# Altium schematic sheet STM32.SchDoc
size A4
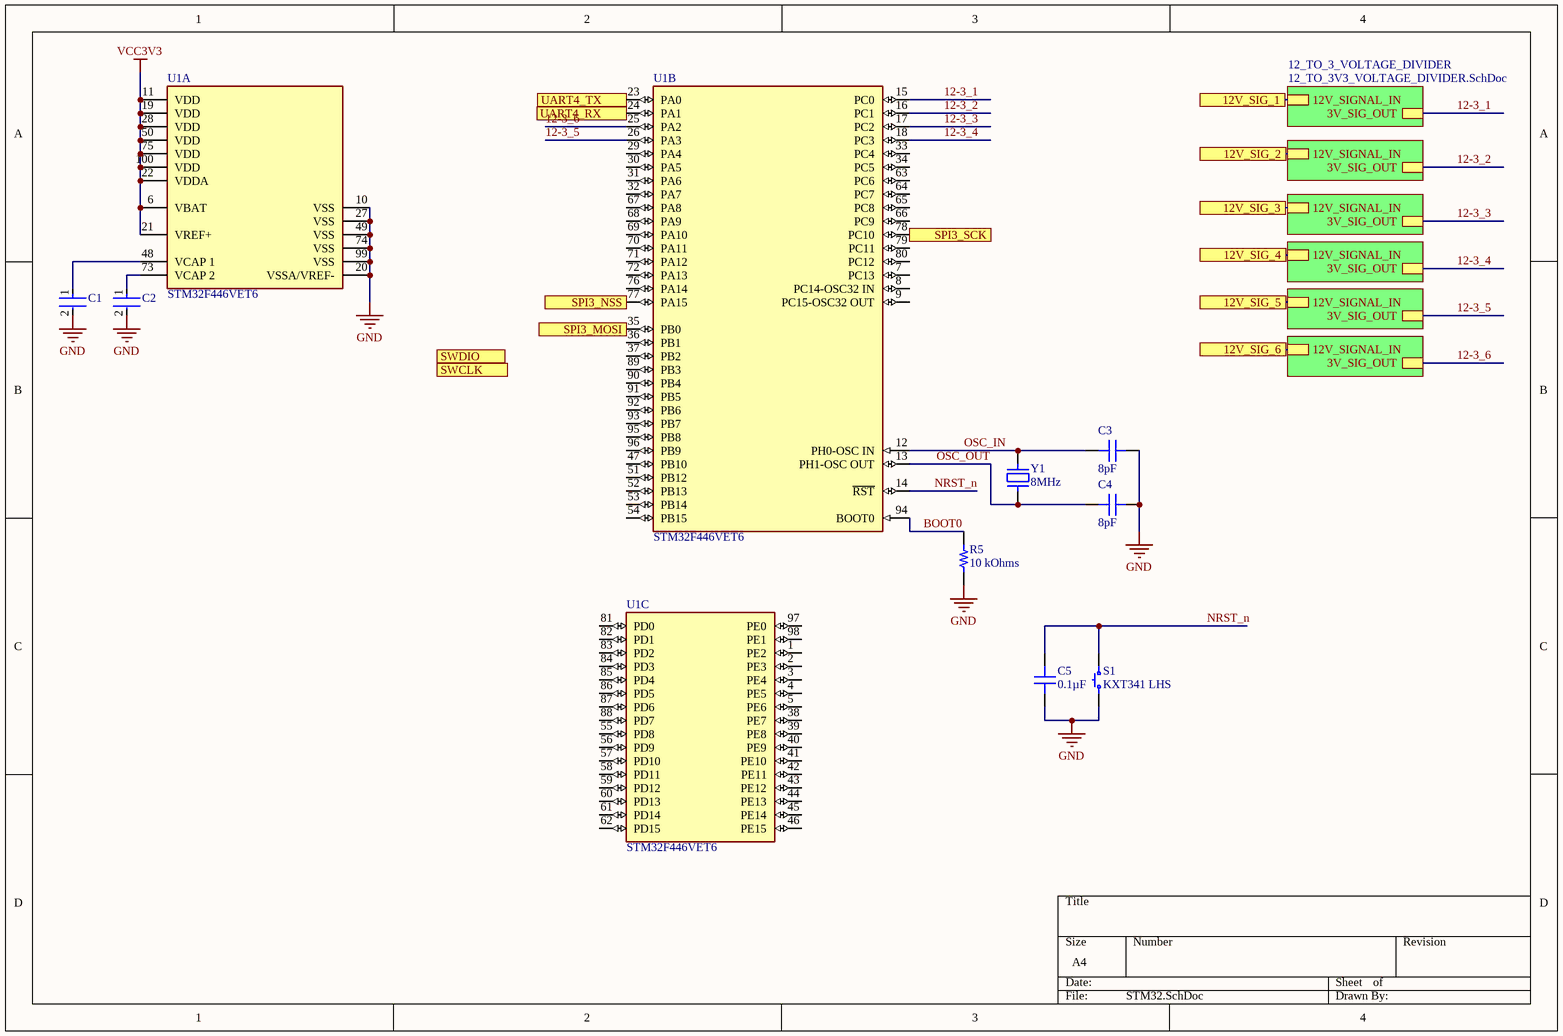
[diagram p0: STM32.SchDoc]

## Parts
C1  GRM188R71A225KE15D  [FP-GRM188-0_1-e0_2_0_5-MFG]  (value not drawn)
C2  GRM188R71A225KE15D  [FP-GRM188-0_1-e0_2_0_5-MFG]  (value not drawn)
C3  8pF  [CAP 0402_1005]
C4  8pF  [CAP 0402_1005]
C5  0.1µF  [CAP 0402_1005]
R5  10 kOhms  [RES 0402_1005]
S1  KXT341 LHS  [C&K KXT3]
U1  STM32F446VET6  [FP-LQFP100-1L-MFG]  (parts A,B,C of 3)
Y1  8MHz  [NDK NX3225GD]

## Sub-sheets
12_TO_3_VOLTAGE_DIVIDER = 12_TO_3V3_VOLTAGE_DIVIDER.SchDoc: 12V_SIGNAL_IN, 3V_SIG_OUT
12_TO_3_VOLTAGE_DIVIDER = 12_TO_3V3_VOLTAGE_DIVIDER.SchDoc: 12V_SIGNAL_IN, 3V_SIG_OUT
12_TO_3_VOLTAGE_DIVIDER = 12_TO_3V3_VOLTAGE_DIVIDER.SchDoc: 12V_SIGNAL_IN, 3V_SIG_OUT
12_TO_3_VOLTAGE_DIVIDER = 12_TO_3V3_VOLTAGE_DIVIDER.SchDoc: 12V_SIGNAL_IN, 3V_SIG_OUT
12_TO_3_VOLTAGE_DIVIDER = 12_TO_3V3_VOLTAGE_DIVIDER.SchDoc: 12V_SIGNAL_IN, 3V_SIG_OUT
12_TO_3_VOLTAGE_DIVIDER = 12_TO_3V3_VOLTAGE_DIVIDER.SchDoc: 12V_SIGNAL_IN, 3V_SIG_OUT

## Ports
12V_SIG_1, 12V_SIG_2, 12V_SIG_3, 12V_SIG_4, 12V_SIG_5, 12V_SIG_6, SPI3_MOSI, SPI3_NSS, SPI3_SCK, SWCLK, SWDIO, UART4_RX, UART4_TX

## Nets
GND: C1.2 C2.2 C3.2 C4.2 C5.1 R5.1 S1.1 U1.10(VSS) U1.20(VSSA/VREF-) U1.27(VSS) U1.49(VSS) U1.74(VSS) U1.99(VSS)
VCC3V3: U1.6(VBAT) U1.11(VDD) U1.19(VDD) U1.21(VREF+) U1.22(VDDA) U1.28(VDD) U1.50(VDD) U1.75(VDD) U1.100(VDD)
12-3_1: U1.15(PC0) ; sheet 12_TO_3_VOLTAGE_DIVIDER/3V_SIG_OUT
12-3_2: U1.16(PC1) ; sheet 12_TO_3_VOLTAGE_DIVIDER/3V_SIG_OUT
12-3_3: U1.17(PC2) ; sheet 12_TO_3_VOLTAGE_DIVIDER/3V_SIG_OUT
12-3_4: U1.18(PC3) ; sheet 12_TO_3_VOLTAGE_DIVIDER/3V_SIG_OUT
12-3_5: U1.26(PA3) ; sheet 12_TO_3_VOLTAGE_DIVIDER/3V_SIG_OUT
12-3_6: U1.25(PA2) ; sheet 12_TO_3_VOLTAGE_DIVIDER/3V_SIG_OUT
12V_SIG_1: port 12V_SIG_1, sheet 12_TO_3_VOLTAGE_DIVIDER/12V_SIGNAL_IN
12V_SIG_2: port 12V_SIG_2, sheet 12_TO_3_VOLTAGE_DIVIDER/12V_SIGNAL_IN
12V_SIG_3: port 12V_SIG_3, sheet 12_TO_3_VOLTAGE_DIVIDER/12V_SIGNAL_IN
12V_SIG_4: port 12V_SIG_4, sheet 12_TO_3_VOLTAGE_DIVIDER/12V_SIGNAL_IN
12V_SIG_5: port 12V_SIG_5, sheet 12_TO_3_VOLTAGE_DIVIDER/12V_SIGNAL_IN
12V_SIG_6: port 12V_SIG_6, sheet 12_TO_3_VOLTAGE_DIVIDER/12V_SIGNAL_IN
BOOT0: R5.2 U1.94(BOOT0)
NRST_n: C5.2 S1.2 U1.14(~{RST})
OSC_IN: C3.1 U1.12(PH0-OSC_IN) Y1.2
OSC_OUT: C4.1 U1.13(PH1-OSC_OUT) Y1.1
SPI3_MOSI: U1.35(PB0) ; port SPI3_MOSI
SPI3_NSS: U1.77(PA15) ; port SPI3_NSS
SPI3_SCK: U1.78(PC10) ; port SPI3_SCK
UART4_RX: U1.24(PA1) ; port UART4_RX
UART4_TX: U1.23(PA0) ; port UART4_TX
NetC1_1: C1.1 U1.48(VCAP_1)
NetC2_1: C2.1 U1.73(VCAP_2)

Not connected (* = marked no-connect by the designer): U1 1(PE2) 2(PE3) 3(PE4) 4(PE5) 5(PE6) 7(PC13) 8(PC14-OSC32_IN) 9(PC15-OSC32_OUT) 29(PA4) 30(PA5) 31(PA6) 32(PA7) 33(PC4) 34(PC5) 36(PB1) 37(PB2) 38(PE7) 39(PE8) 40(PE9) 41(PE10) 42(PE11) 43(PE12) 44(PE13) 45(PE14) 46(PE15) 47(PB10) 51(PB12) 52(PB13) 53(PB14) 54(PB15) 55(PD8) 56(PD9) 57(PD10) 58(PD11) 59(PD12) 60(PD13) 61(PD14) 62(PD15) 63(PC6) 64(PC7) 65(PC8) 66(PC9) 67(PA8) 68(PA9) 69(PA10) 70(PA11) 71(PA12) 72(PA13) 76(PA14) 79(PC11) 80(PC12) 81(PD0) 82(PD1) 83(PD2) 84(PD3) 85(PD4) 86(PD5) 87(PD6) 88(PD7) 89(PB3) 90(PB4) 91(PB5) 92(PB6) 93(PB7) 95(PB8) 96(PB9) 97(PE0) 98(PE1)

## Library data of the parts
C1 C2 = CMP-2006-02836-2: Chip Multilayer Ceramic Capacitors for General Purpose, 0603, 2.2uF, X7R, 15%, 10%, 10V; Case Code (Metric): 1608; Height: 0.8mm; Packaging: Cut Tape; Voltage: 10V; Lead Free: Lead Free; Min Operating Temperature: -55°C; Voltage Rating (DC): 10V; Max Operating Temperature: 125°C; Voltage Rating: 10V; Dielectric: X7R; Depth: 0.8mm; Case Code (Imperial): 0603; Termination: SMD/SMT; Case/Package: 0603; Number of Pins: 2; REACH SVHC: No SVHC; Mount: Surface Mount; Width: 0.031inch; Material: Ceramic; Capacitance: 2.2uF; Package Quantity: 1; Weight: 7.1E-05oz; Length: 1.6mm; Thickness: 0.035inch; Tolerance: 10%
C3 C4 = C1005NP01H080D050BA: CAP CER 8PF 50V NP0 0402; Manufacturer: TDK Corporation; Temperature Coefficient: C0G, NP0; Tolerance: ±0.5pF; Part Number: C1005NP01H080D050BA; Value: 8pF; Applications: General Purpose; Capacitance: 8pF; ComponentLink1Description: Datasheet; ComponentLink1URL: https://product.tdk.com/info/en/catalog/datasheets/mlcc_commercial_hightemp_en.pdf?ref_disty=digikey; ComponentLink2Description: DigiKey Link; ComponentLink2URL: http://digikey.com/product-detail/en/tdk-corporation/C1005NP01H080D050BA/445-13781-1-ND/3955447; Device Package: 0402 (1005 Metric); Features: High Temperature; LastUpdated: 2020-09-02 1:02:24 AM; Lifecycle Status: Active; Minimum Order: 1; Mounting Type: Surface Mount, MLCC; Operating Temperature: -55°C ~ 150°C; Package / Case: 0402 (1005 Metric); Packaging: TapeAndReel; PartId: 2033; Part Status: Active; Price: 0.01; Series: C; Size / Dimension: 0.039" L x 0.020" W (1.00mm x 0.50mm); Supplier 1: DigiKey; Supplier Part Number 1: 445-13781-1-ND; Thickness (Max): 0.022" (0.55mm); Voltage - Rated: 50V
C5 = C0402C104K4RECAUTO: CAP CER 0402 0.1UF 16V X7R 10%; Manufacturer: KEMET; Part Number: C0402C104K4RECAUTO; Value: 0.1µF; Applications: Automotive, ESD Protection; Capacitance: 0.1µF; ComponentLink1Description: Datasheet; ComponentLink1URL: https://api.kemet.com/component-edge/download/datasheet/C0402C104K4RECAUTO.pdf; ComponentLink2Description: DigiKey Link; ComponentLink2URL: http://digikey.com/product-detail/en/kemet/C0402C104K4RECAUTO/399-17167-1-ND/8563708; Device Package: 0402 (1005 Metric); LastUpdated: 2020-09-02 1:02:25 AM; Lifecycle Status: Active; Minimum Order: 1; Mounting Type: Surface Mount, MLCC; Operating Temperature: -55°C ~ 125°C; Package / Case: 0402 (1005 Metric); Packaging: TapeAndReel; PartId: 1731; Part Status: Active; Price: 0.02; Series: ESD SMD Auto X7R; Size / Dimension: 0.039" L x 0.020" W (1.00mm x 0.50mm); Supplier 1: DigiKey; Supplier Part Number 1: 399-17167-1-ND; Temperature Coefficient: X7R; Thickness (Max): 0.022" (0.55mm); Tolerance: ±10%; Voltage - Rated: 16V; Ratings: AEC-Q200
R5 = CRCW040210K0DHEDP: RES SMD 10K OHM 0.5% 1/16W 0402; Manufacturer: Vishay Dale; Power (Watts): 0.063W, 1/16W; Temperature Coefficient: ±50ppm/°C; Part Number: CRCW040210K0DHEDP; Value: 10 kOhms; ComponentLink1Description: Datasheet; ComponentLink1URL: http://www.vishay.com/docs/20036/dcrcwpe3.pdf; ComponentLink2Description: DigiKey Link; ComponentLink2URL: http://digikey.com/product-detail/en/vishay-dale/CRCW040210K0DHEDP/541-10KAVCT-ND/3593906; Composition: Thick Film; Device Package: 0402 (1005 Metric); Height - Seated (Max): 0.016" (0.40mm); LastUpdated: 2020-09-02 1:08:05 AM; Lifecycle Status: Active; Minimum Order: 1; Number of Terminations: 2; Operating Temperature: -55°C ~ 155°C; Package / Case: 0402 (1005 Metric); Packaging: TapeAndReel; PartId: 5057; Part Status: Active; Price: 0.03; Resistance: 10 kOhms; Series: CRCW-P; Size / Dimension: 0.039" L x 0.020" W (1.00mm x 0.50mm); Supplier 1: DigiKey; Supplier Part Number 1: 541-10KAVCT-ND; Supplier Device Package: 0402; Tolerance: ±0.5%; Features: Automotive AEC-Q200; Ratings: AEC-Q200
S1 = KXT341 LHS: SWITCH TACTILE SPST-NO 0.02A 15V; Manufacturer: C&K; Actuator Height off PCB, Vertical: 0.60mm; Actuator Orientation: Top Actuated; Actuator Type: Standard; Contact Rating @ Voltage: 0.02A @ 15VDC; Illumination: Non-Illuminated; Operating Force: 330gf; Outline: 3.00mm x 2.00mm; Switch Function: Off-Mom; Part Number: KXT341 LHS; Circuit: SPST-NO; ComponentLink1Description: Datasheet; ComponentLink1URL: https://dznh3ojzb2azq.cloudfront.net/products/Tactile/KXT3/documents/datasheet.pdf; ComponentLink2Description: DigiKey Link; ComponentLink2URL: http://digikey.com/product-detail/en/c-k/KXT341-LHS/CKN10781CT-ND/6607324; LastUpdated: 2020-09-02 1:27:07 AM; Lifecycle Status: Active; Minimum Order: 1; Mounting Type: Surface Mount; Operating Temperature: -40°C ~ 85°C; Packaging: TapeAndReel; Part Status: Active; Price: 0.14; Series: KXT3; Supplier 1: DigiKey; Supplier Part Number 1: CKN10781CT-ND; Termination Style: SMD (SMT) Tab
U1 = CMP-12105-000075-1: IC MCU 32BIT 512KB FLASH 100LQFP; Manufacturer: STMicroelectronics; Ram Size: 128KBytes; Data Bus Width: 32bits; Max Junction Temp: +125°C; Number Of Adc Channels: 16; Max Supply Voltage: 3.6V; Nominal Supply Current: 1.4-86mA; Number Of Uart Channels: 6; Core Architecture: ARM Cortex-M4; Standoff Height: 0.05mm; Number Of A/D Converters: 3; Frequency: 180MHz; Number Of Cores: 1; Min Supply Voltage: 1.65V; Number Of Timers/Counters: 14; Number Of Usb Channels: 2; Number Of Spi Channels: 4; Interface: I2C,SPI,UART,USART,Parallel,CAN,USB,LIN,IrDA,I2S,Other; Memory Size: 512KBytes; Number Of I/Os: 81; Ambient Temperature Range High: +85°C; Mouser Description: ARM Microcontrollers - MCU High-performance and DSP with FPU, ARM Cortex-M4 MCU with 512 Kbytes Flash, 180 MHz CPU, Art Accelerator, SDRAM; Device Class L2: Embedded Processors and Controllers; Temperature Range Low: -40°C; Device Class L1: Integrated Circuits (ICs); RoHS: TRUE; Ipc Land Pattern Name: QFP50P1600X1600X160-100; Manufacturer Part Number: STM32F446VET6; Octopart: https://octopart.com/stm32f446vet6-stmicroelectronics-52642922; Package: LQFP100-1L; Automotive: No; Category: IC; ComponentLink2URL: https://www.st.com/resource/en/datasheet/stm32f446ve.pdf; Digikey Description: IC MCU 32BIT 512KB FLASH 100LQFP; Temperature Range High: +85°C; Memory Type: FLASH; Lead Free: Yes; Height: 1.6mm; ComponentLink2Description: Datasheet; Number Of I2C Channels: 4; Device Class L3: Microcontrollers; Temperature: -40°C to +85°C; Ambient Temperature Range Low: -40°C
Y1 = NX3225GD-8MHZ-STD-CRA-3: CRYSTAL 8.0000MHZ 8PF SMD; Manufacturer: NDK America, Inc.; ESR (Equivalent Series Resistance): 500 Ohms; Frequency Stability: ±150ppm; Frequency Tolerance: ±50ppm; Operating Mode: Fundamental; Part Number: NX3225GD-8MHZ-STD-CRA-3; ComponentLink1Description: Datasheet; ComponentLink1URL: http://www.ndk.com/images/products/catalog/c_NX3225GD-STD-CRA-3_e.pdf; ComponentLink2Description: DigiKey Link; ComponentLink2URL: http://digikey.com/product-detail/en/ndk-america-inc/NX3225GD-8MHZ-STD-CRA-3/644-1178-1-ND/3125567; Frequency: 8MHz; Height - Seated (Max): 0.039" (1.00mm); LastUpdated: 2020-09-02 1:25:56 AM; Lifecycle Status: Active; Load Capacitance: 8pF; Minimum Order: 1; Mounting Type: Surface Mount; Operating Temperature: -40°C ~ 150°C; Package / Case: 2-SMD, No Lead; Packaging: TapeAndReel; PartId: 744; Part Status: Active; Price: 0.48; Ratings: AEC-Q200; Series: NX3225GD; Size / Dimension: 0.126" L x 0.098" W (3.20mm x 2.50mm); Supplier 1: DigiKey; Supplier Part Number 1: 644-1178-1-ND; Type: MHz Crystal; Value: 8MHz